# Altium schematic sheet connectors.SchDoc
size A; SheetNumber: 1; SheetTotal: 7
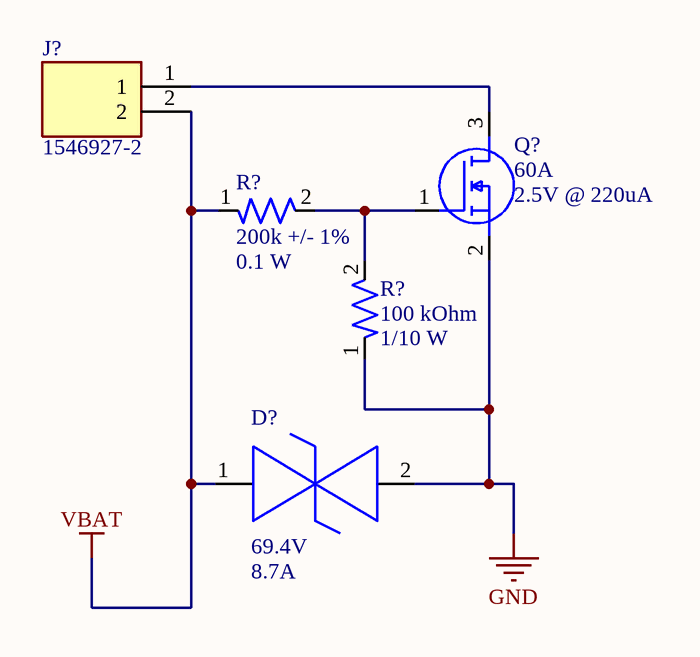
[diagram p0: connectors.SchDoc]

## Parts
(Parts that share a designator on the sheet are numbered #1, #2 ... from top to bottom, then left to right.)
D?  Vclamp: 69.4V  Peak pulser current: 8.7A  [DO-214AA (SMBJ)]  (hidden comment: SMBJE43CAH)
J?  1546927-2  [SHDR2W119P0X826_1X2_1770X1549X1549P]
Q?  Drain Current: 60A  Vgs: 2.5V @ 220uA  [NMOS-8PowerVDFN]  (hidden comment: TPH7R006PL,L1Q)
R?#1  Resistance: 200k +/- 1%  Power Rating: 0.1 W  [RES-0603]  (hidden comment: ERJ-3EKF2003V)
R?#2  Resistance: 100 kOhm  Power: 1/10 W  [RES-0603]  (hidden comment: RC0603FR-07100KL)

## Nets
GND: D?.2 Q?.2(S) R?#2.1
VBAT: D?.1 J?.2 R?#1.1
NetJ?_1: J?.1 Q?.3(D)
NetQ?_1: Q?.1(G) R?#1.2 R?#2.2

## Library data of the parts
D? = DIO-69.4V-0001: 69.4V Clamp 8.7A Ipp Tvs Diode Surface Mount DO-214AA (SMBJ); Channels: Bidirectional; Breakdown VOltage: 47.8V; Reverse working maximum voltage: 43V; Package: DO-214AA (SMBJ)
J? = 1546927-2: Connector; Manufacturer_Name: TE Connectivity; Datasheet Link: https://www.te.com/commerce/DocumentDelivery/DDEController?Action=showdoc&DocId=Customer+Drawing%7F1546927%7FA3%7Fpdf%7FEnglish%7FENG_CD_1546927_A3.pdf%7F1546927-2; Height: 15.494mm; Manufacturer_Part_Number: 1546927-2; Mouser Part Number: 571-1546927-2; Mouser Price/Stock: https://www.mouser.co.uk/ProductDetail/TE-Connectivity/1546927-2?qs=30v%252BXxGwGAoQPG4oeAAMCA%3D%3D; Arrow Part Number: 1546927-2; Arrow Price/Stock: https://www.arrow.com/en/products/1546927-2/te-connectivity
Q? = NMOS-60A-0001: N-Channel 60 V 60A (Tc) 81W (Tc) Surface Mount 8-SOP Advance (5x5); Vdss: 60V; Vgs(Max): 20V; Package: 8-PowerVDFN
R?#1 = RES-200K-0001: 200 kOhms ±1% 0.1W, 1/10W Chip Resistor 0603 (1608 Metric) Automotive AEC-Q200 Thick Film; Manufacturer: Panasonic Electronic Components; Assembled?: Yes; MFP: ERJ-3EKF2003V; Package SIze: 0603
R?#2 = RES-100K-0003: 100 kOhms ±1% 0.1W, 1/10W Chip Resistor 0603 (1608 Metric) Moisture Resistant Thick Film; Tolerance: +/- 1%; Assembled?: No; Package Size: 0603